# Altium schematic sheet Adapter_UARTSPI_RS485_0.SchDoc
size 409 x 279 mm; Author: Wendel; PROJECT_NAME: Adapter_UARTSPI_RS485; VERSION: Version 1.0; Origin: Eagle
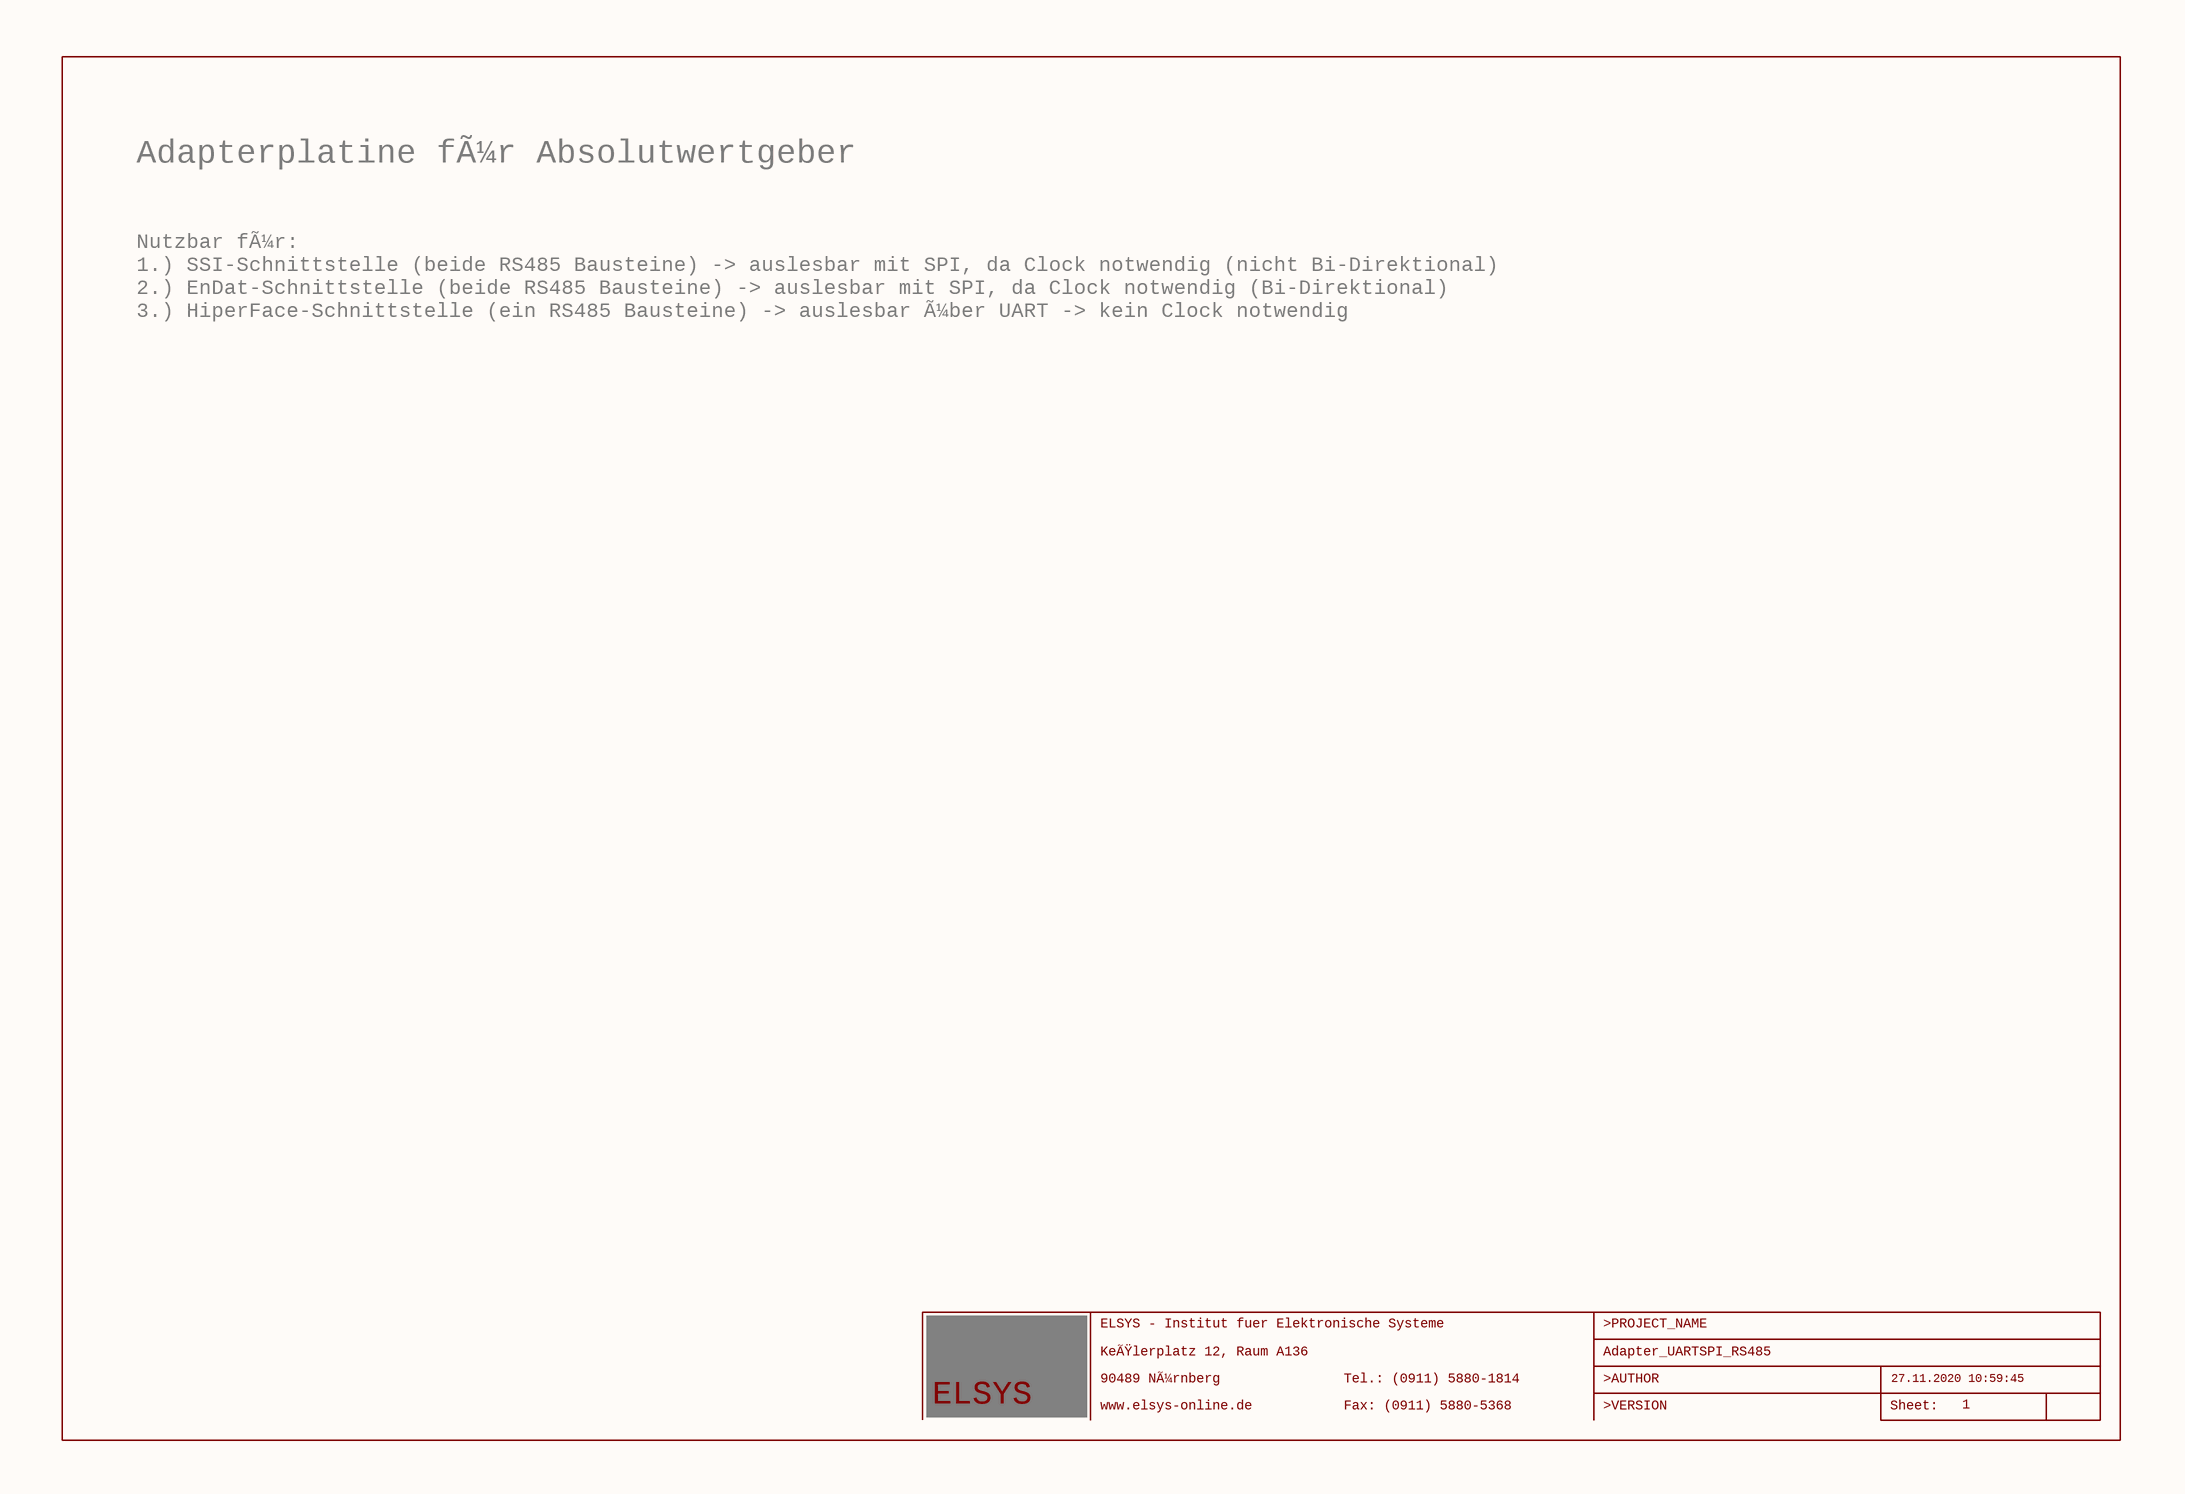
[diagram p0: Adapter_UARTSPI_RS485_0.SchDoc]

## Parts
FRAME3  DRAWING_NAME: Adapter_UARTSPI_RS485  LAST_DATE_TIME: 27.11.2020 10:59:45  SHEET: 1  Sheet: Sheet:  ELSYS-InstitutfuerElektronischeSysteme: ELSYS - Institut fuer Elektronische Systeme  AUTHOR: >AUTHOR  VERSION: >VERSION  KeÃŸlerplatz12,RaumA136: KeÃŸlerplatz 12, Raum A136  90489NÃ¼rnberg: 90489 NÃ¼rnberg  Tel.:(0911)5880-1814: Tel.: (0911) 5880-1814  Fax:(0911)5880-5368: Fax: (0911) 5880-5368  PROJECT_NAME: >PROJECT_NAME  (hidden comment: A3L-LOC)

## Notes on the sheet
- Adapterplatine fÃ¼r Absolutwertgeber
- Nutzbar fÃ¼r:
  1.) SSI-Schnittstelle (beide RS485 Bausteine) -> auslesbar mit SPI, da Clock notwendig (nicht Bi-Direktional)
  2.) EnDat-Schnittstelle (beide RS485 Bausteine) -> auslesbar mit SPI, da Clock notwendig (Bi-Direktional)
  3.) HiperFace-Schnittstelle (ein RS485 Bausteine) -> auslesbar Ã¼ber UART -> kein Clock notwendig

## Library data of the parts
FRAME3 = A3L-LOC: RAHMEN   ELSYS Rahmen fuer Schaltplan; GateName_1: G$1; SymbolName_1: A3L-LOC; LibraryName: Elsys - Rahmen - Eagle v5; DeviceSetName: A3L-LOC; www.elsys-online.de: www.elsys-online.de; ELSYS: ELSYS